# Altium project monitoring.PrjPcb
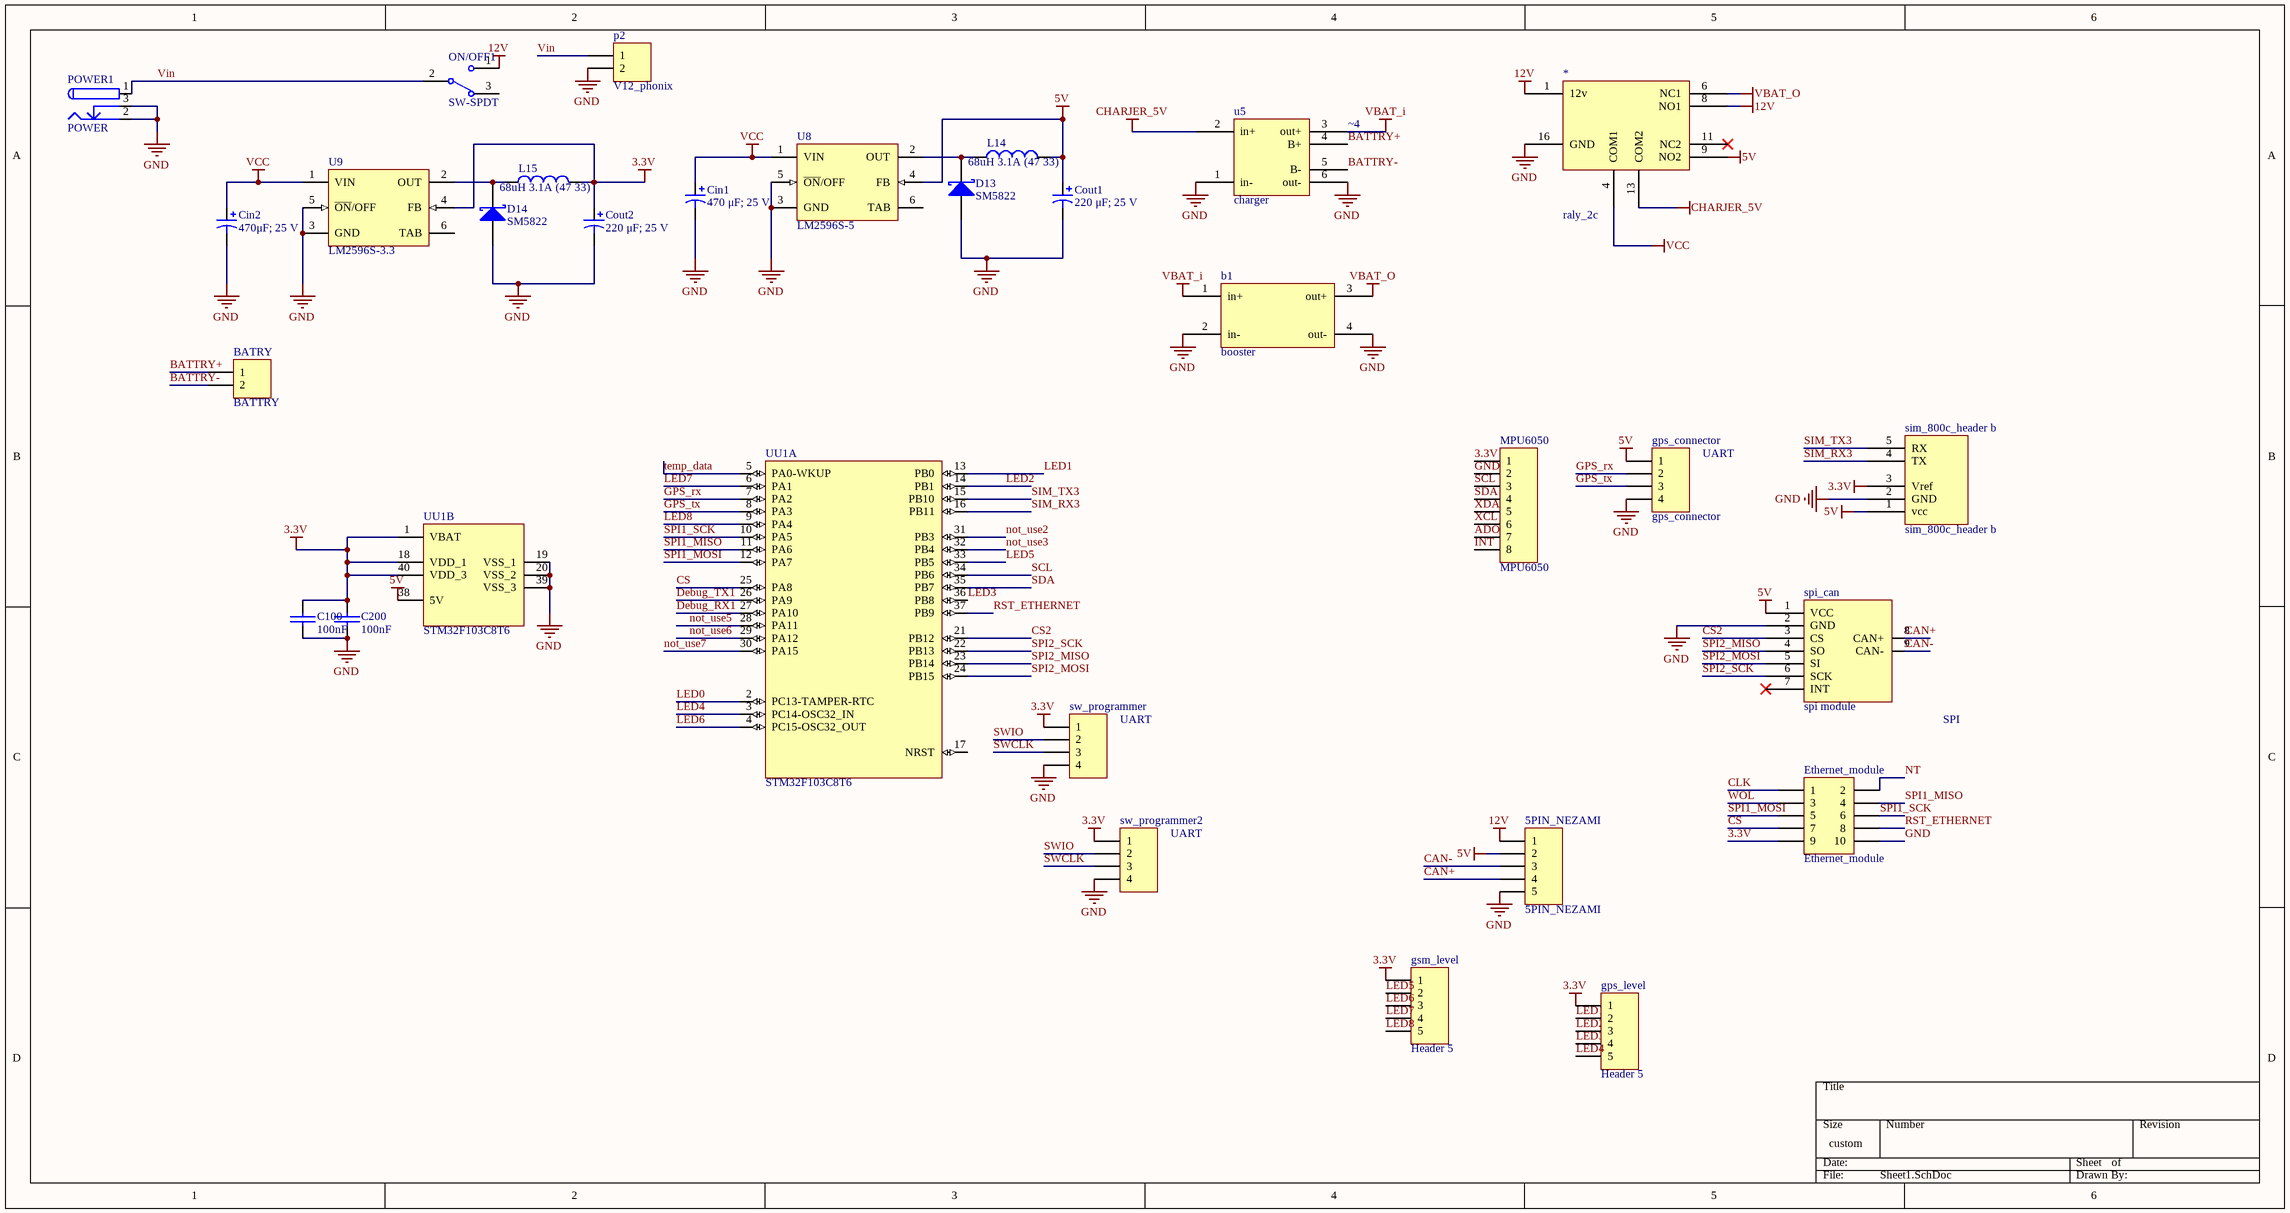
[diagram p0: Sheet1.SchDoc]
3 sheets, 116 parts. Net scope: flat (ports and power ports of the same name join across sheets).
Sheets:
  Sheet1.SchDoc
  Sheet2.SchDoc
  windsensor.SchDoc

## Sheet Sheet1.SchDoc
size 457 x 241 mm

### Parts
5PIN_NEZAMI  5PIN_NEZAMI  [5PIN_NEZAMI_CAN]
*  raly_2c  [RELAY12-2c-HJR1-2C]
b1  booster  [booster]
BATRY  BATTRY  [HDR1X2]
C100  100nF  [1206]
C200  100nF  [1206]
Cin1  470 μF; 25 V  [E]
Cin2  470μF; 25 V  [E]
Cout1  220 μF; 25 V  [E]
Cout2  220 μF; 25 V  [E]
D13  SM5822  [SMB]
D14  SM5822  [SMB]
Ethernet_module  Ethernet_module  [ethernet_module]
gps_connector  gps_connector  [GPS_PORT_MODULE]
gps_level  Header 5  [HDR1X5]
gsm_level  Header 5  [HDR1X5]
L14  68uH 3.1A (47 33)  [CAPR5-4X5]
L15  68uH 3.1A (47 33)  [CAPR5-4X5]
MPU6050  MPU6050  [mpu6050]
ON/OFF1  SW-SPDT  [TL36WW15050]
p2  V12_phonix  [phoenix terminal R 2]
POWER1  POWER  [POWERIN]
sim_800c_header_b  sim_800c_header b  [SIM800_MODULE]
spi_can  spi module  [SPI_CAN]
sw_programmer  (no value)  [HDR1X4]
sw_programmer2  (no value)  [HDR1X4]
u5  charger  [CHARGER]
U8  LM2596S-5  [TS5B_N]
U9  LM2596S-3.3  [TS5B_N]
UU1  STM32F103C8T6  [header_board_st_40]  (parts A,B of 2)

### Nets
3.3V: C100.1(+) C200.1(+) Cout2.1 Ethernet_module.9 gps_level.1 gsm_level.1 L15.2 MPU6050.1 sim_800c_header_b.3(Vref) sw_programmer.1 sw_programmer2.1 U9.4(FB) UU1.1(VBAT) UU1.18(VDD_1) UU1.40(VDD_3)
5V: 5PIN_NEZAMI.2 *.9(NO2) Cout1.1 gps_connector.1 L14.2 sim_800c_header_b.1(vcc) spi_can.1(VCC) U8.4(FB) UU1.38(5V)
12V: 5PIN_NEZAMI.1 *.1(12v) *.8(NO1) ON/OFF1.1
CHARJER_5V: *.13(COM2) u5.2(in+)
GND: 5PIN_NEZAMI.5 *.16(GND) b1.2(in-) b1.4(out-) C100.2(-) C200.2(-) Cin1.2 Cin2.2 Cout1.2 Cout2.2 D13.1(A) D14.1(A) Ethernet_module.10 gps_connector.4 MPU6050.2 p2.2 POWER1.2 POWER1.3 sim_800c_header_b.2(GND) spi_can.2(GND) sw_programmer.4 sw_programmer2.4 u5.1(in-) u5.6(out-) U8.3(GND) U8.5(~{ON}/OFF) U9.3(GND) U9.5(~{ON}/OFF) UU1.19(VSS_1) UU1.20(VSS_2) UU1.39(VSS_3)
VBAT_i: b1.1(in+) u5.3(out+)
VBAT_O: *.6(NC1) b1.3(out+)
VCC: *.4(COM1) Cin1.1 Cin2.1 U8.1(VIN) U9.1(VIN)
ADO: MPU6050.7
BATTRY+: BATRY.1 u5.4(B+)
BATTRY-: BATRY.2 u5.5(B-)
CAN+: 5PIN_NEZAMI.4 spi_can.8(CAN+)
CAN-: 5PIN_NEZAMI.3 spi_can.9(CAN-)
CLK: Ethernet_module.1
CS: Ethernet_module.7 UU1.25(PA8)
CS2: spi_can.3(CS) UU1.21(PB12)
Debug_RX1: UU1.27(PA10)
Debug_TX1: UU1.26(PA9)
GPS_rx: gps_connector.2 UU1.7(PA2)
GPS_tx: gps_connector.3 UU1.8(PA3)
INT: MPU6050.8
LED0: UU1.2(PC13-TAMPER-RTC)
LED1: gps_level.2 UU1.13(PB0)
LED2: gps_level.3 UU1.14(PB1)
LED3: gps_level.4 UU1.36(PB8)
LED4: gps_level.5 UU1.3(PC14-OSC32_IN)
LED5: gsm_level.2 UU1.33(PB5)
LED6: gsm_level.3 UU1.4(PC15-OSC32_OUT)
LED7: gsm_level.4 UU1.6(PA1)
LED8: gsm_level.5 UU1.9(PA4)
not_use2: UU1.31(PB3)
not_use3: UU1.32(PB4)
not_use5: UU1.28(PA11)
not_use6: UU1.29(PA12)
not_use7: UU1.30(PA15)
NT: Ethernet_module.2
RST_ETHERNET: Ethernet_module.8 UU1.37(PB9)
SCL: MPU6050.3 UU1.34(PB6)
SDA: MPU6050.4 UU1.35(PB7)
SIM_RX3: sim_800c_header_b.4(TX) UU1.16(PB11)
SIM_TX3: sim_800c_header_b.5(RX) UU1.15(PB10)
SPI1_MISO: Ethernet_module.4 UU1.11(PA6)
SPI1_MOSI: Ethernet_module.5 UU1.12(PA7)
SPI1_SCK: Ethernet_module.6 UU1.10(PA5)
SPI2_MISO: spi_can.4(SO) UU1.23(PB14)
SPI2_MOSI: spi_can.5(SI) UU1.24(PB15)
SPI2_SCK: spi_can.6(SCK) UU1.22(PB13)
SWCLK: sw_programmer.3 sw_programmer2.3
SWIO: sw_programmer.2 sw_programmer2.2
temp_data: UU1.5(PA0-WKUP)
Vin: ON/OFF1.2 p2.1 POWER1.1
WOL: Ethernet_module.3
XCL: MPU6050.6
XDA: MPU6050.5
NetD13_2: D13.2(K) L14.1 U8.2(OUT)
NetD14_2: D14.2(K) L15.1 U9.2(OUT)

Not connected (* = marked no-connect by the designer): * 11(NC2)*; ON/OFF1 3; POWER1 1A 1B 2A 2B 3A 3B; spi_can 7(INT)*; U8 6(TAB); U9 6(TAB); UU1 17(NRST)

### Notes on the sheet
- (near u5) ~4
- UART
- SPI

### Library data of the parts
5PIN_NEZAMI = 5PIN_NEZAMI: Header, 8-Pin; LatestRevisionDate: 17-Jul-2002; LatestRevisionNote: Re-released for DXP Platform.; Publisher: Altium Limited
BATRY p2 = Header 2: Header, 2-Pin; LatestRevisionDate: 17-Jul-2002; LatestRevisionNote: Re-released for DXP Platform.; Publisher: Altium Limited
C100 C200 = Cap-Bipolar: Bipolar Capacitor; Voltage: 100V; Designer: Saeid Jorablo; Organazation: ControTec; Adding Date: 1387/12/20; Value: 100nF
Cin1 Cin2 Cout1 Cout2 = 94SH107X0016EBP: Solid Aluminum Capacitor with Organic Semiconductor Electrolyte: 100uF, 16V, Bulk Pack; Note: Part Numbers shown are for ± 20% capacitance tolerance (X0).; PCB_Layout: Complies with Manufacturer's Recommendation.; DrillSize: Nominal, Rounded to the nearest 0.1mm; Published: 19-Mar-2004; DatasheetDocument: 23-May-2001; PackageReference: E; Publisher: Altium Limited; ComponentLink1Description: Manufacturer Link; ComponentLink1URL: http://www.vishay.com/; ComponentLink2Description: Datasheet; ComponentLink2URL: http://www.vishay.com/docs/90006/94sh.pdf; Value: 100uF
D13 D14 = D Schottky: Schottky Diode; Published: 8-Jun-2000; LatestRevisionDate: 17-Jul-2002; LatestRevisionNote: Re-released for DXP Platform.; PackageReference: SMB; Publisher: Altium Limited; PackageDescription: DO-214-AA/SMB; 2 C-Bend Leads; Body 5.3 x 3.6 mm, inc. leads (LxW); Code_JEDEC: DO-214-AA
Ethernet_module = Header 5X2: Header, 5-Pin, Dual row; LatestRevisionDate: 17-Jul-2002; LatestRevisionNote: Re-released for DXP Platform.; Publisher: Altium Limited
gps_connector sw_programmer sw_programmer2 = Header 4: Header, 4-Pin; LatestRevisionDate: 17-Jul-2002; LatestRevisionNote: Re-released for DXP Platform.; Publisher: Altium Limited
gps_level gsm_level = Header 5: Header, 5-Pin; LatestRevisionDate: 17-Jul-2002; LatestRevisionNote: Re-released for DXP Platform.; Publisher: Altium Limited
L14 L15 = Inductor: Code_IEC: 1005; Value: 10mH; Published: 8-Jun-2000; LatestRevisionDate: 29-May-2009; LatestRevisionNote: IPC-7351 Footprint Added.; PackageReference: 0402-A; Publisher: Altium Limited; PackageDescription: Chip Inductor; Code_JEITA: 0402
MPU6050 = Header 8: Header, 8-Pin; LatestRevisionDate: 17-Jul-2002; LatestRevisionNote: Re-released for DXP Platform.; Publisher: Altium Limited
ON/OFF1 = SW-SPDT: SPDT Subminiature Toggle Switch, Right Angle Mounting, Vertical Actuation; Published: 24-Mar-1999; LatestRevisionDate: 17-Dec-2003; LatestRevisionNote: Schematic revised, PCB Footprint replaced.; DatasheetVersion: 05-Dec-2000; PackageReference: TL36WW15050; Publisher: Altium Limited; PackageDescription: Switch; 4 Leads; ComponentLink1Description: Manufacturer Link; ComponentLink1URL: http://www.apem.com
POWER1 = PWR2.5: Low Voltage Power Supply Connector; Published: 17-Dec-2003; DatasheetDocument: 09-May-2002; Publisher: Altium Limited; ComponentLink1Description: Manufacturer Link; ComponentLink1URL: http://domino.kycon.com/internet/Products.html
u5 = 03962A
U8 U9 = LM2596S-ADJ: SIMPLE SWITCHER® Power Converter 150 KHz 3A Step-Down Voltage Regulator, 5-pin TO-263; Manufacturer: National Semiconductor; PackageTopMarking: NSUZXYTTE#*LM2596S*-ADJ P+; PowerWise: N; Published: 4-Dec-2008; DatasheetVersion: May-2002; PackageVersion: revD, Apr-2005; PackageReference: TS5B; Publisher: Altium Limited; PackageDescription: TO-263, Molded, .400 x .390 x .180in, 5 Lead, .067in Pitch, Surface Mount; Supplier 1: Farnell; Supplier Part Number 1: 1523864; Supplier 2: Farnell; Supplier Part Number 2: 9494367; PartNumber: LM2596S-ADJ; RoHS: N; PinCount: 5; CompType: Switcher; Code_JEDEC: MO-169-AB; ComponentLink1Description: LM2596 Datasheet; ComponentLink1URL: http://www.national.com/ds/LM/LM2596.pdf; ComponentLink2Description: LM2596 Web Page; ComponentLink2URL: http://www.national.com/pf/LM/LM2596.html; ComponentLink3Description: TS5B Package Page; ComponentLink3URL: http://www.national.com/packaging/folders/ts5b.html
UU1 = STM32F103C8T6: ARM Cortex-M3 32-bit MCU, 64 KB Flash, 20 KB Internal RAM, 37 I/Os, 48-pin LQFP, -40 to 85 degC, Tray; A/D Converter: 2x12-bit (10 Channel); FLASH Size (Prog) (kB): 64; I/Os (High Current): 37; Internal RAM Size (kB): 20; Operating Frequency(F) (Processor speed) (MHz): 72; Supply Voltage(Vcc) min (V): 2; DatasheetVersion: Rev. 16; PackageVersion: Rev. 6, 06/2013; PackageReference: LQFP48; PackageDescription: 48-Pin Low Profile Quad Flat Package, 7 x 7 mm Body, 0.5 mm Pitch; Supplier 1: Digi-Key; Supplier Part Number 1: 497-6063-ND; Supplier 2: Farnell; Supplier Part Number 2: 1447637; Supplier 3: Newark; Supplier Part Number 3: 59M2182; Supplier 4: Newark; Supplier Part Number 4: 57P1222; Supplier 5: Mouser; Supplier Part Number 5: 511-STM32F103C8T6; Core: ARM Cortex-M3; Packing: Tray; Mounting Technology: Surface Mount; PartNumber: STM32F103C8T6; ComponentLink1Description: Manufacturer URL; ComponentLink1URL: http://www.st.com/web/en/home.html; ComponentLink2Description: Datasheet; ComponentLink2URL: http://www.st.com/st-web-ui/static/active/en/resource/technical/document/datasheet/CD00161566.pdf; ComponentLink3Description: Package Specification; ComponentLink3URL: http://www.st.com/st-web-ui/static/active/en/resource/technical/document/datasheet/DM00058181.pdf

## Sheet Sheet2.SchDoc
size 381 x 241 mm
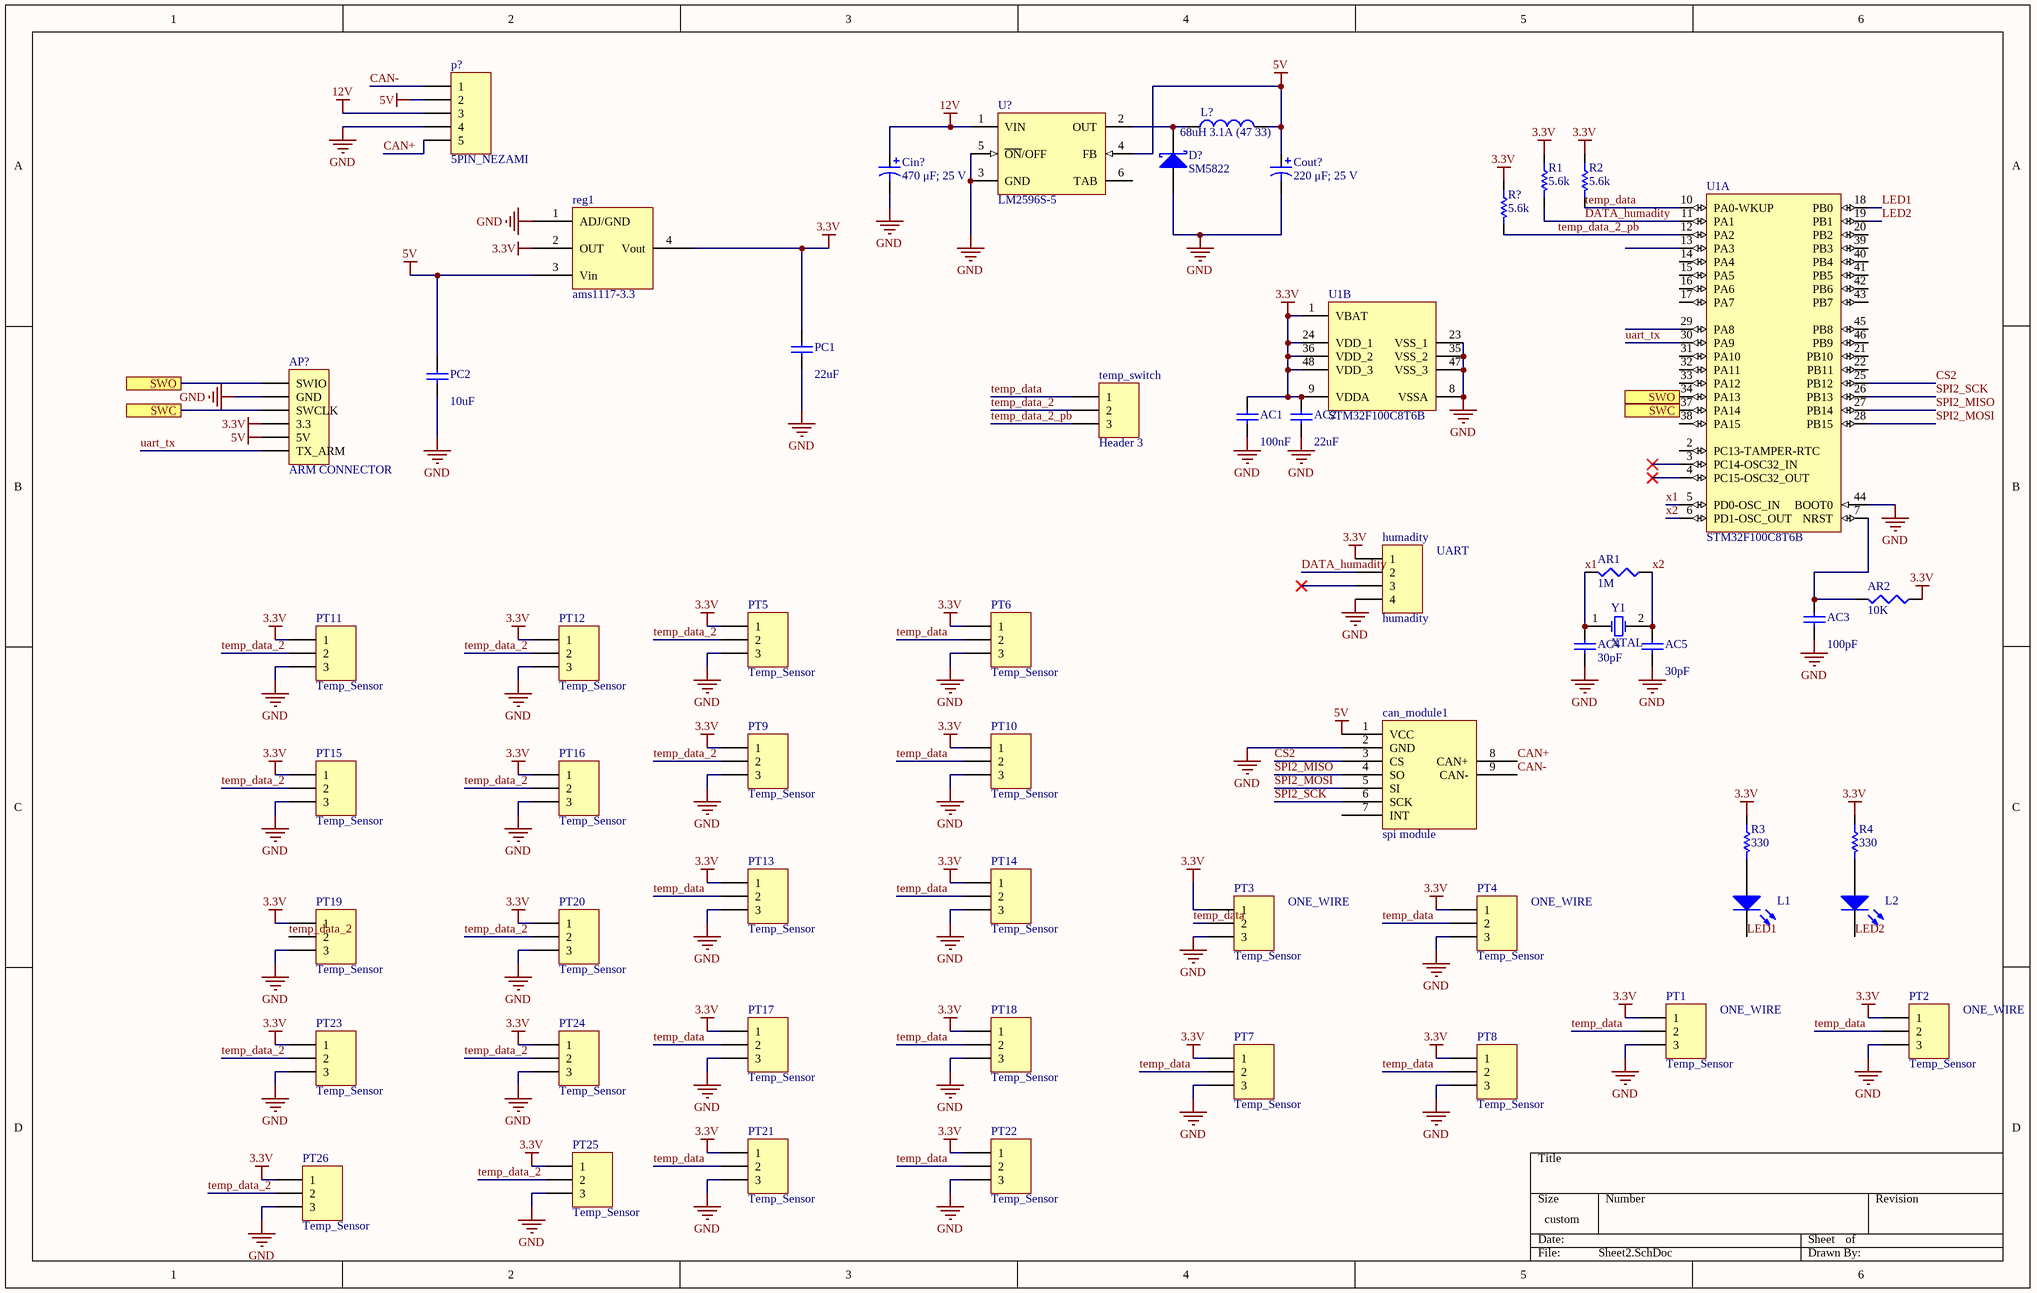
[diagram p1: Sheet2.SchDoc]

### Parts
(Parts that share a designator on the sheet are numbered #1, #2 ... from top to bottom, then left to right.)
AC1#1  value 100nF  [C1206]  (hidden comment: Cap Semi)
AC2#1  value 22uF  [C1206]  (hidden comment: Cap Semi)
AC3#1  value 100pF  [C1206]  (hidden comment: Cap Semi)
AC4  value 30pF  [C1206]  (hidden comment: Cap Semi)
AC5  value 30pF  [C1206]  (hidden comment: Cap Semi)
AP?  ARM CONNECTOR  [HDR1X6]
AR1#1  value 1M  [c1206]  (hidden comment: Res3)
AR2  value 10K  [c1206]  (hidden comment: Res3)
can_module1  spi module  [SPI_CAN]
Cin?#1  470 μF; 25 V  [E]
Cout?  220 μF; 25 V  [E]
D?  SM5822  [SMB]
humadity  humadity  [HDR1X4]
L1#1  LED2  [C1206]  (value not drawn)
L2  LED2  [C1206]  (value not drawn)
L?  68uH 3.1A (47 33)  [CAPR5-4X5]
p?  5PIN_NEZAMI  [5PIN_NEZAMI_CAN]
PC1#1  value 22uF  [C1206]  (hidden comment: Cap Semi)
PC2  value 10uF  [C1206]  (hidden comment: PC1)
PT1  Temp_Sensor  [HDR1X3]
PT2  Temp_Sensor  [HDR1X3]
PT3  Temp_Sensor  [HDR1X3]
PT4  Temp_Sensor  [HDR1X3]
PT5  Temp_Sensor  [HDR1X3]
PT6  Temp_Sensor  [HDR1X3]
PT7  Temp_Sensor  [HDR1X3]
PT8  Temp_Sensor  [HDR1X3]
PT9  Temp_Sensor  [HDR1X3]
PT10  Temp_Sensor  [HDR1X3]
PT11  Temp_Sensor  [HDR1X3]
PT12  Temp_Sensor  [HDR1X3]
PT13  Temp_Sensor  [HDR1X3]
PT14  Temp_Sensor  [HDR1X3]
PT15  Temp_Sensor  [HDR1X3]
PT16  Temp_Sensor  [HDR1X3]
PT17  Temp_Sensor  [HDR1X3]
PT18  Temp_Sensor  [HDR1X3]
PT19  Temp_Sensor  [HDR1X3]
PT20  Temp_Sensor  [HDR1X3]
PT21  Temp_Sensor  [HDR1X3]
PT22  Temp_Sensor  [HDR1X3]
PT23  Temp_Sensor  [HDR1X3]
PT24  Temp_Sensor  [HDR1X3]
PT25  Temp_Sensor  [HDR1X3]
PT26  Temp_Sensor  [HDR1X3]
R1  5.6k  [1206]
R2  5.6k  [1206]
R3  330  [1206]
R4  330  [1206]
R?  5.6k  [1206]
reg1  ams1117-3.3  [SOT223_N]
temp_switch  Header 3  [HDR1X3]
U1#1  STM32F100C8T6B  [STM-LQFP48_N]  (parts A,B of 2)
U?  LM2596S-5  [TS5B_N]
Y1#1  XTAL  [RAD-0.2]

### Ports
SWC, SWO

### Nets
3.3V: AC1#1.1 AC2#1.1 AP?.4(3.3) AR2.1 humadity.1 PC1#1.1 PT1.1 PT2.1 PT3.1 PT4.1 PT5.1 PT6.1 PT7.1 PT8.1 PT9.1 PT10.1 PT11.1 PT12.1 PT13.1 PT14.1 PT15.1 PT16.1 PT17.1 PT18.1 PT19.1 PT20.1 PT21.1 PT22.1 PT23.1 PT24.1 PT25.1 PT26.1 R1.1 R2.1 R3.1 R4.1 R?.1 reg1.2(OUT) reg1.4(Vout) U1#1.1(VBAT) U1#1.9(VDDA) U1#1.24(VDD_1) U1#1.36(VDD_2) U1#1.48(VDD_3)
5V: AP?.5(5V) can_module1.1(VCC) Cout?.1 L?.2 p?.2 PC2.1 reg1.3(Vin) U?.4(FB)
12V: Cin?#1.1 p?.3 U?.1(VIN)
GND: AC1#1.2 AC2#1.2 AC3#1.2 AC4.2 AC5.2 AP?.2(GND) can_module1.2(GND) Cin?#1.2 Cout?.2 D?.1(A) humadity.4 p?.4 PC1#1.2 PC2.2 PT1.3 PT2.3 PT3.3 PT4.3 PT5.3 PT6.3 PT7.3 PT8.3 PT9.3 PT10.3 PT11.3 PT12.3 PT13.3 PT14.3 PT15.3 PT16.3 PT17.3 PT18.3 PT19.3 PT20.3 PT21.3 PT22.3 PT23.3 PT24.3 PT25.3 PT26.3 reg1.1(ADJ/GND) U1#1.8(VSSA) U1#1.23(VSS_1) U1#1.35(VSS_2) U1#1.44(BOOT0) U1#1.47(VSS_3) U?.3(GND) U?.5(~{ON}/OFF)
CAN+: can_module1.8(CAN+) p?.5
CAN-: can_module1.9(CAN-) p?.1
CS2: can_module1.3(CS) U1#1.25(PB12)
DATA_humadity: humadity.2 R1.2 U1#1.11(PA1)
LED1: L1#1.2(K) U1#1.18(PB0)
LED2: L2.2(K) U1#1.19(PB1)
SPI2_MISO: can_module1.4(SO) U1#1.27(PB14)
SPI2_MOSI: can_module1.5(SI) U1#1.28(PB15)
SPI2_SCK: can_module1.6(SCK) U1#1.26(PB13)
temp_data: PT1.2 PT2.2 PT3.2 PT4.2 PT6.2 PT7.2 PT8.2 PT10.2 PT13.2 PT14.2 PT17.2 PT18.2 PT21.2 PT22.2 R2.2 temp_switch.1 U1#1.10(PA0-WKUP)
temp_data_2: PT5.2 PT9.2 PT11.2 PT12.2 PT15.2 PT16.2 PT19.2 PT20.2 PT23.2 PT24.2 PT25.2 PT26.2 temp_switch.2
temp_data_2_pb: R?.2 temp_switch.3 U1#1.12(PA2)
uart_tx: AP?.6(TX_ARM) U1#1.30(PA9)
x1: AC4.1 AR1#1.2 U1#1.5(PD0-OSC_IN) Y1#1.1(OSC1)
x2: AC5.1 AR1#1.1 U1#1.6(PD1-OSC_OUT) Y1#1.2(OSC2)
NetAC3#1_1: AC3#1.1 AR2.2 U1#1.7(NRST)
NetAP1_1: AP?.1(SWIO) U1#1.34(PA13) ; port SWO
NetAP1_3: AP?.3(SWCLK) U1#1.37(PA14) ; port SWC
NetD?_2: D?.2(K) L?.1 U?.2(OUT)
NetL1#1_1: L1#1.1(A) R3.2
NetL2_1: L2.1(A) R4.2

Not connected (* = marked no-connect by the designer): can_module1 7(INT); humadity 3*; U1#1 2(PC13-TAMPER-RTC) 3(PC14-OSC32_IN)* 4(PC15-OSC32_OUT)* 13(PA3) 14(PA4) 15(PA5) 16(PA6) 17(PA7) 20(PB2) 21(PB10) 22(PB11) 29(PA8) 31(PA10) 32(PA11) 33(PA12) 38(PA15) 39(PB3) 40(PB4) 41(PB5) 42(PB6) 43(PB7) 45(PB8) 46(PB9); U? 6(TAB)

### Notes on the sheet
- UART
- ONE_WIRE

### Library data of the parts
AC1#1 AC2#1 AC3#1 AC4 AC5 PC1#1 PC2 = Cap Semi: Capacitor (Semiconductor SIM Model); Published: 8-Jun-2000; LatestRevisionDate: 29-May-2009; LatestRevisionNote: IPC-7351 Footprint Added.; PackageReference: C1206; Publisher: Altium Limited; PackageDescription: Chip Capacitor
AP? = Header 6: Header, 6-Pin; LatestRevisionDate: 17-Jul-2002; LatestRevisionNote: Re-released for DXP Platform.; Publisher: Altium Limited
AR1#1 AR2 = Res3: Resistor; Published: 8-Jun-2000; LatestRevisionDate: 29-May-2009; LatestRevisionNote: IPC-7351 Footprint Added.; PackageReference: J1-0603; Publisher: Altium Limited; PackageDescription: Chip Resistor
Cin?#1 Cout? = 94SH107X0016EBP: as Cin1 on sheet Sheet1; Published: 19-Mar-2004; DatasheetDocument: 23-May-2001; PackageReference: E; Publisher: Altium Limited; ComponentLink1Description: Manufacturer Link; ComponentLink1URL: http://www.vishay.com/; ComponentLink2Description: Datasheet; ComponentLink2URL: http://www.vishay.com/docs/90006/94sh.pdf; Value: 100uF
D? = D Schottky: Schottky Diode; Published: 8-Jun-2000; LatestRevisionDate: 17-Jul-2002; LatestRevisionNote: Re-released for DXP Platform.; PackageReference: SMB; Publisher: Altium Limited; PackageDescription: DO-214-AA/SMB; 2 C-Bend Leads; Body 5.3 x 3.6 mm, inc. leads (LxW); Code_JEDEC: DO-214-AA
humadity = Header 4: Header, 4-Pin; LatestRevisionDate: 17-Jul-2002; LatestRevisionNote: Re-released for DXP Platform.; Publisher: Altium Limited
L1#1 L2 = LED2: Typical RED, GREEN, YELLOW, AMBER GaAs LED; Published: 8-Jun-2000; LatestRevisionDate: 17-Jul-2002; LatestRevisionNote: Re-released for DXP Platform.; PackageVersion: Feb-2002; PackageReference: 3.2X1.6X1.1; Publisher: Altium Limited; PackageDescription: SM LED; 2 Flat Leads
L? = Inductor: Code_IEC: 1005; Value: 10mH; Published: 8-Jun-2000; LatestRevisionDate: 29-May-2009; LatestRevisionNote: IPC-7351 Footprint Added.; PackageReference: 0402-A; Publisher: Altium Limited; PackageDescription: Chip Inductor; Code_JEITA: 0402
p? = 5PIN_NEZAMI: Header, 8-Pin; LatestRevisionDate: 17-Jul-2002; LatestRevisionNote: Re-released for DXP Platform.; Publisher: Altium Limited
PT1-PT26 temp_switch = Header 3: Header, 3-Pin; LatestRevisionDate: 17-Jul-2002; LatestRevisionNote: Re-released for DXP Platform.; Publisher: Altium Limited
R1-R4 R? = Resistor
  R1 R2 R?: Value: 5.6k
  R3 R4: Value: 330
U1#1 = STM32F100C8T6B: ARM Cortex-M3 32-bit MCU, 64 KB Flash, 8 KB Internal RAM, 37 I/Os, 48-pin LQFP, -40 to 85 degC, Tray; A/D Converter: 1x12-bit (10 Channel); D/A Converter: 2x12-bit (2 Channel); FLASH Size (Prog) (kB): 64; I/Os (High Current): 37; Internal RAM Size (kB): 8; Operating Frequency(F) (Processor speed) (MHz): 24; Supply Voltage(Vcc) min (V): 2; DatasheetVersion: Rev. 7; PackageVersion: Rev. 6, 06/2013; PackageReference: LQFP48; PackageDescription: 48-Pin Low Profile Quad Flat Package, 7 x 7 mm Body, 0.5 mm Pitch; Supplier 1: Digi-Key; Supplier Part Number 1: 497-10499-ND; Supplier 2: Farnell; Supplier Part Number 2: 1838511; Supplier 3: Newark; Supplier Part Number 3: 76R0988; Supplier 4: Mouser; Supplier Part Number 4: 511-STM32F100C8T6B; Core: ARM Cortex-M3; Packing: Tray; Mounting Technology: Surface Mount; PartNumber: STM32F100C8T6B; ComponentLink1Description: Manufacturer URL; ComponentLink1URL: http://www.st.com/web/en/home.html; ComponentLink2Description: Datasheet; ComponentLink2URL: http://www.st.com/st-web-ui/static/active/en/resource/technical/document/datasheet/CD00251732.pdf; ComponentLink3Description: Package Specification; ComponentLink3URL: http://www.st.com/st-web-ui/static/active/en/resource/technical/document/datasheet/DM00058181.pdf
U? = LM2596S-ADJ: as U8 on sheet Sheet1; Published: 4-Dec-2008; DatasheetVersion: May-2002; PackageVersion: revD, Apr-2005; PackageReference: TS5B; Publisher: Altium Limited; PackageDescription: TO-263, Molded, .400 x .390 x .180in, 5 Lead, .067in Pitch, Surface Mount; Supplier 1: Farnell; Supplier Part Number 1: 1523864; Supplier 2: Farnell; Supplier Part Number 2: 9494367; PartNumber: LM2596S-ADJ; RoHS: N; PinCount: 5; CompType: Switcher; Code_JEDEC: MO-169-AB; ComponentLink1Description: LM2596 Datasheet; ComponentLink1URL: http://www.national.com/ds/LM/LM2596.pdf; ComponentLink2Description: LM2596 Web Page; ComponentLink2URL: http://www.national.com/pf/LM/LM2596.html; ComponentLink3Description: TS5B Package Page; ComponentLink3URL: http://www.national.com/packaging/folders/ts5b.html
Y1#1 = XTAL: Crystal Oscillator; Published: 8-Jun-2000; LatestRevisionDate: 17-Jul-2002; LatestRevisionNote: Re-released for DXP Platform.; PackageReference: R38; Publisher: Altium Limited; PackageDescription: Crystal, Thru-Hole; 2 Leads; Body 3.1 x 8.2 mm (Dia.xH)

## Sheet windsensor.SchDoc
size A
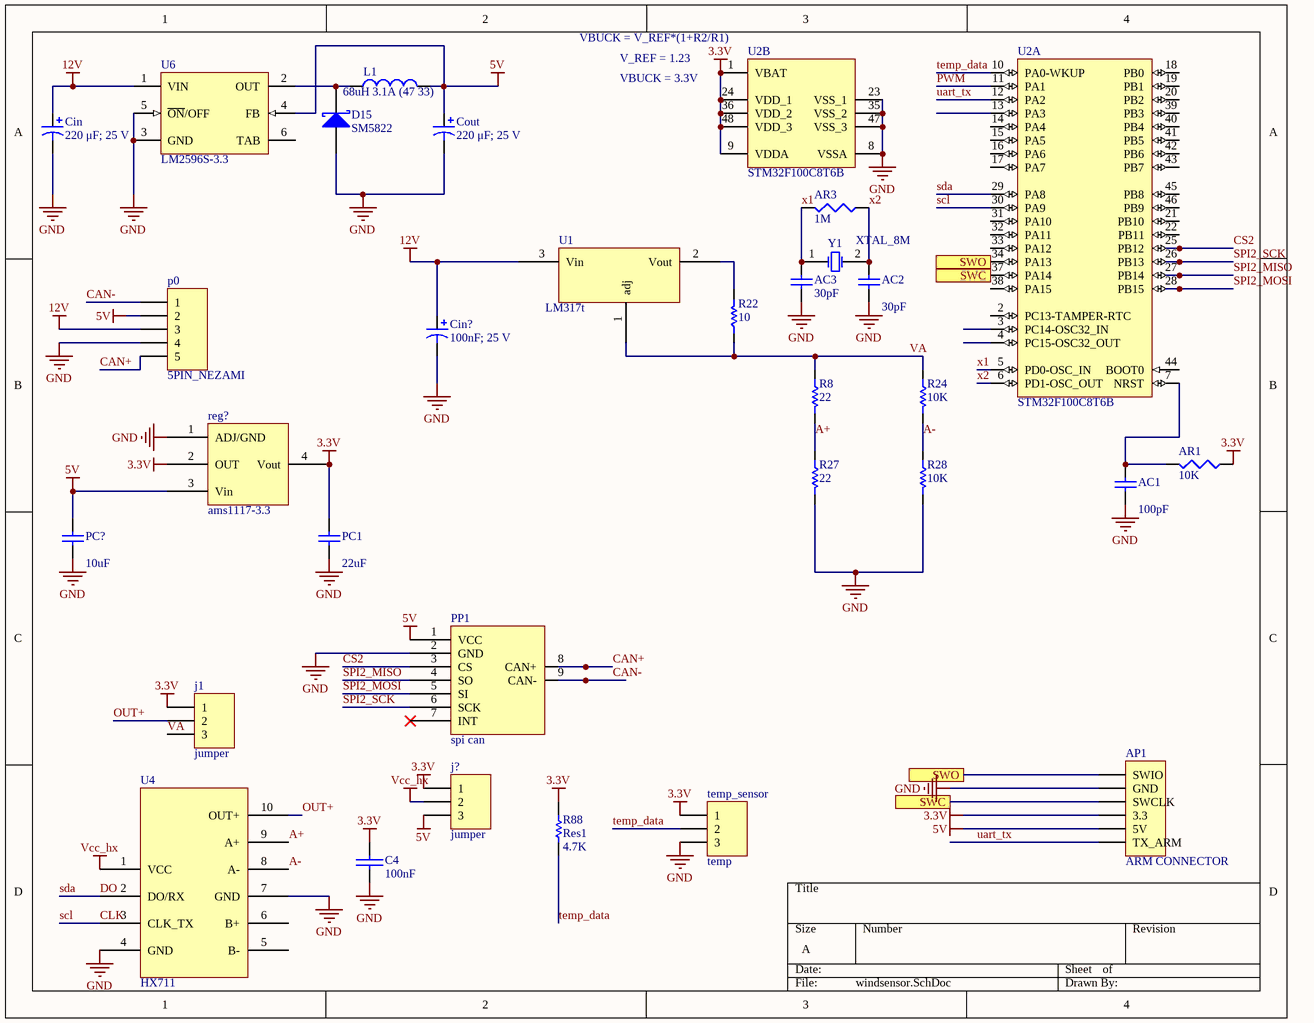
[diagram p2: windsensor.SchDoc]

### Parts
(Parts that share a designator on the sheet are numbered #1, #2 ... from top to bottom, then left to right.)
AC1#2  value 100pF  [1608[0603]]  (hidden comment: Cap Semi)
AC2#2  value 30pF  [C1206]  (hidden comment: Cap Semi)
AC3#2  value 30pF  [C1206]  (hidden comment: Cap Semi)
AP1  ARM CONNECTOR  [HDR1X6]
AR1#2  value 10K  [J1-0603]  (hidden comment: Res3)
AR3  value 1M  [14-1210]  (hidden comment: Res3)
C4  100nF  [C1206]
Cin  220 μF; 25 V  [E]
Cin?#2  100nF; 25 V  [C1206]
Cout  220 μF; 25 V  [E]
D15  SM5822  [SMB]
j1  jumper  [HDR1X3]
j?  jumper  [HDR1X3]
L1#2  68uH 3.1A (47 33)  [CAPR5-4X5]
p0  5PIN_NEZAMI  [5PIN_NEZAMI_CAN]
PC1#2  value 22uF  [C1206]  (hidden comment: Cap Semi)
PC?  value 10uF  [C1206]  (hidden comment: PC1)
PP1  spi can  [SPI_CAN]
R8  22  [1206]
R22  10  [1206]
R24  10K  [1206]
R27  22  [1206]
R28  10K  [1206]
R88  Res1  value 4.7K  [1206]
reg?  ams1117-3.3  [ams]
temp_sensor  temp  [HDR1X3]
U1#2  LM317t  [LM317T]
U2  STM32F100C8T6B  [STM-LQFP48_N]  (parts A,B of 2)
U4  HX711  [HX711_BREAKOUT_GREEN]
U6  LM2596S-3.3  [TS5B_N]
Y1#2  XTAL_8M  [RAD-0.2]

### Ports
SWC, SWO

### Nets
3.3V: AP1.4(3.3) AR1#2.1 C4.1(+) j1.1 j?.1 PC1#2.1 R88.1 reg?.2(OUT) reg?.4(Vout) temp_sensor.1 U2.1(VBAT) U2.9(VDDA) U2.24(VDD_1) U2.36(VDD_2) U2.48(VDD_3)
5V: AP1.5(5V) Cout.1 j?.3 L1#2.2 p0.2 PC?.1 PP1.1(VCC) reg?.3(Vin) U6.4(FB)
12V: Cin.1 Cin?#2.1 p0.3 U1#2.3(Vin) U6.1(VIN)
GND: AC1#2.2 AC2#2.2 AC3#2.2 AP1.2(GND) C4.2(-) Cin.2 Cin?#2.2 Cout.2 D15.1(A) p0.4 PC1#2.2 PC?.2 PP1.2(GND) R27.2 R28.2 reg?.1(ADJ/GND) temp_sensor.3 U2.8(VSSA) U2.23(VSS_1) U2.35(VSS_2) U2.47(VSS_3) U4.4(GND) U4.7(GND) U6.3(GND) U6.5(~{ON}/OFF)
Vcc_hx: j?.2 U4.1(VCC)
A+: R8.2 R27.1 U4.9(A+)
A-: R24.2 R28.1 U4.8(A-)
CAN+: p0.5 PP1.8(CAN+)
CAN-: p0.1 PP1.9(CAN-)
CLK: U2.30(PA9) U4.3(CLK_TX)  [also labelled scl]
CS2: PP1.3(CS) U2.25(PB12)
DO: U2.29(PA8) U4.2(DO/RX)  [also labelled sda]
OUT+: j1.2 U4.10(OUT+)
PWM: U2.11(PA1)
SPI2_MISO: PP1.4(SO) U2.27(PB14)
SPI2_MOSI: PP1.5(SI) U2.28(PB15)
SPI2_SCK: PP1.6(SCK) U2.26(PB13)
temp_data: R88.2 temp_sensor.2 U2.10(PA0-WKUP)
uart_tx: AP1.6(TX_ARM) U2.12(PA2)
VA: j1.3 R8.1 R22.1 R24.1 U1#2.1(adj)
x1: AC3#2.1 AR3.2 U2.5(PD0-OSC_IN) Y1#2.1(OSC1)
x2: AC2#2.1 AR3.1 U2.6(PD1-OSC_OUT) Y1#2.2(OSC2)
NetAC1#2_1: AC1#2.1 AR1#2.2 U2.7(NRST)
NetAP1_1: AP1.1(SWIO) U2.34(PA13) ; port SWO
NetAP1_3: AP1.3(SWCLK) U2.37(PA14) ; port SWC
NetD15_2: D15.2(K) L1#2.1 U6.2(OUT)
NetR22_2: R22.2 U1#2.2(Vout)

Not connected (* = marked no-connect by the designer): PP1 7(INT)*; U2 2(PC13-TAMPER-RTC) 3(PC14-OSC32_IN) 4(PC15-OSC32_OUT) 13(PA3) 14(PA4) 15(PA5) 16(PA6) 17(PA7) 18(PB0) 19(PB1) 20(PB2) 21(PB10) 22(PB11) 31(PA10) 32(PA11) 33(PA12) 38(PA15) 39(PB3) 40(PB4) 41(PB5) 42(PB6) 43(PB7) 44(BOOT0) 45(PB8) 46(PB9); U4 5(B-) 6(B+); U6 6(TAB)

### Notes on the sheet
- (near U2) VBUCK = V_REF*(1+R2/R1)
- VBUCK = 3.3V
- V_REF = 1.23

### Library data of the parts
AC1#2 AC2#2 AC3#2 PC1#2 PC? = Cap Semi: Capacitor (Semiconductor SIM Model); Published: 8-Jun-2000; LatestRevisionDate: 29-May-2009; LatestRevisionNote: IPC-7351 Footprint Added.; PackageReference: C1206; Publisher: Altium Limited; PackageDescription: Chip Capacitor
AP1 = Header 6: Header, 6-Pin; LatestRevisionDate: 17-Jul-2002; LatestRevisionNote: Re-released for DXP Platform.; Publisher: Altium Limited
AR1#2 AR3 = Res3: Resistor; Published: 8-Jun-2000; LatestRevisionDate: 29-May-2009; LatestRevisionNote: IPC-7351 Footprint Added.; PackageReference: J1-0603; Publisher: Altium Limited; PackageDescription: Chip Resistor
C4 = Cap-Bipolar: as C100 on sheet Sheet1; Adding Date: 1387/12/20; Value: 100nF
Cin Cin?#2 Cout = 94SH107X0016EBP: as Cin1 on sheet Sheet1; Published: 19-Mar-2004; DatasheetDocument: 23-May-2001; PackageReference: E; Publisher: Altium Limited; ComponentLink1Description: Manufacturer Link; ComponentLink1URL: http://www.vishay.com/; ComponentLink2Description: Datasheet; ComponentLink2URL: http://www.vishay.com/docs/90006/94sh.pdf; Value: 100uF
D15 = D Schottky: Schottky Diode; Published: 8-Jun-2000; LatestRevisionDate: 17-Jul-2002; LatestRevisionNote: Re-released for DXP Platform.; PackageReference: SMB; Publisher: Altium Limited; PackageDescription: DO-214-AA/SMB; 2 C-Bend Leads; Body 5.3 x 3.6 mm, inc. leads (LxW); Code_JEDEC: DO-214-AA
j1 j? temp_sensor = Header 3: Header, 3-Pin; LatestRevisionDate: 17-Jul-2002; LatestRevisionNote: Re-released for DXP Platform.; Publisher: Altium Limited
L1#2 = Inductor: Code_IEC: 1005; Value: 10mH; Published: 8-Jun-2000; LatestRevisionDate: 29-May-2009; LatestRevisionNote: IPC-7351 Footprint Added.; PackageReference: 0402-A; Publisher: Altium Limited; PackageDescription: Chip Inductor; Code_JEITA: 0402
p0 = 5PIN_NEZAMI: Header, 8-Pin; LatestRevisionDate: 17-Jul-2002; LatestRevisionNote: Re-released for DXP Platform.; Publisher: Altium Limited
PP1 = spi module
R8 R22 R24 R27 R28 = Resistor
  R8 R27: Value: 22
  R22: Value: 10
  R24 R28: Value: 10K
R88 = Res1: Resistor; Published: 8-Jun-2000; LatestRevisionDate: 17-Jul-2002; LatestRevisionNote: Re-released for DXP Platform.; PackageReference: AXIAL-0.3; Publisher: Altium Limited; PackageDescription: Axial Device, Thru-Hole; 2 Leads; 0.3 in Pin Spacing
U2 = STM32F100C8T6B: as U1#1 on sheet Sheet2; DatasheetVersion: Rev. 7; PackageVersion: Rev. 6, 06/2013; PackageReference: LQFP48; PackageDescription: 48-Pin Low Profile Quad Flat Package, 7 x 7 mm Body, 0.5 mm Pitch; Supplier 1: Digi-Key; Supplier Part Number 1: 497-10499-ND; Supplier 2: Farnell; Supplier Part Number 2: 1838511; Supplier 3: Newark; Supplier Part Number 3: 76R0988; Supplier 4: Mouser; Supplier Part Number 4: 511-STM32F100C8T6B; Core: ARM Cortex-M3; Packing: Tray; Mounting Technology: Surface Mount; PartNumber: STM32F100C8T6B; ComponentLink1Description: Manufacturer URL; ComponentLink1URL: http://www.st.com/web/en/home.html; ComponentLink2Description: Datasheet; ComponentLink2URL: http://www.st.com/st-web-ui/static/active/en/resource/technical/document/datasheet/CD00251732.pdf; ComponentLink3Description: Package Specification; ComponentLink3URL: http://www.st.com/st-web-ui/static/active/en/resource/technical/document/datasheet/DM00058181.pdf
U4 = HX711_BreakoutBoard: Breakout_Board
U6 = LM2596S-ADJ: as U8 on sheet Sheet1; Published: 4-Dec-2008; DatasheetVersion: May-2002; PackageVersion: revD, Apr-2005; PackageReference: TS5B; Publisher: Altium Limited; PackageDescription: TO-263, Molded, .400 x .390 x .180in, 5 Lead, .067in Pitch, Surface Mount; Supplier 1: Farnell; Supplier Part Number 1: 1523864; Supplier 2: Farnell; Supplier Part Number 2: 9494367; PartNumber: LM2596S-ADJ; RoHS: N; PinCount: 5; CompType: Switcher; Code_JEDEC: MO-169-AB; ComponentLink1Description: LM2596 Datasheet; ComponentLink1URL: http://www.national.com/ds/LM/LM2596.pdf; ComponentLink2Description: LM2596 Web Page; ComponentLink2URL: http://www.national.com/pf/LM/LM2596.html; ComponentLink3Description: TS5B Package Page; ComponentLink3URL: http://www.national.com/packaging/folders/ts5b.html
Y1#2 = XTAL: Crystal Oscillator; Published: 8-Jun-2000; LatestRevisionDate: 17-Jul-2002; LatestRevisionNote: Re-released for DXP Platform.; PackageReference: R38; Publisher: Altium Limited; PackageDescription: Crystal, Thru-Hole; 2 Leads; Body 3.1 x 8.2 mm (Dia.xH)

## Nets that join several sheets
3.3V: Sheet1 (15 pins), Sheet2 (44 pins), windsensor (15 pins)
5V: Sheet1 (9 pins), Sheet2 (8 pins), windsensor (9 pins)
12V: Sheet1 (5PIN_NEZAMI.1 *.1 *.8 ON/OFF1.1), Sheet2 (Cin?#1.1 p?.3 U?.1), windsensor (5 pins)
GND: Sheet1 (31 pins), Sheet2 (48 pins), windsensor (25 pins)
NetAP1_1: Sheet2 (AP?.1 U1#1.34), windsensor (AP1.1 U2.34)
NetAP1_3: Sheet2 (AP?.3 U1#1.37), windsensor (AP1.3 U2.37)